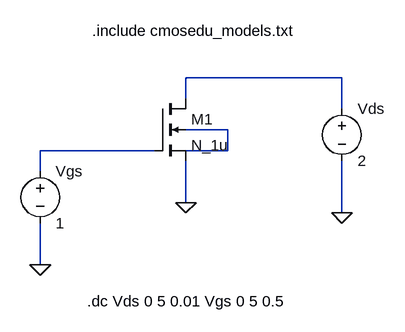
[diagram p0: schematic Parte3.asc]
Parte3.asc, the LTspice schematic file:
Version 4
SHEET 1 880 680
WIRE 384 64 144 64
WIRE 144 96 144 64
WIRE 384 112 384 64
WIRE 208 144 144 144
WIRE 96 176 -80 176
WIRE 208 176 208 144
WIRE 208 176 144 176
WIRE -80 208 -80 176
WIRE 144 256 144 192
WIRE 384 272 384 192
WIRE -80 352 -80 288
FLAG 144 256 0
FLAG 384 272 0
FLAG -80 352 0
SYMBOL nmos4 96 96 R0
SYMATTR InstName M1
SYMATTR Value N_1u
SYMATTR Value2 l=1.5u w=9.6u
SYMBOL voltage 384 96 R0
WINDOW 123 0 0 Left 2
WINDOW 39 0 0 Left 2
SYMATTR InstName Vds
SYMATTR Value 2
SYMBOL voltage -80 192 R0
WINDOW 123 0 0 Left 2
WINDOW 39 0 0 Left 2
SYMATTR InstName Vgs
SYMATTR Value 1
TEXT 0 -8 Left 2 !.include cmosedu_models.txt
TEXT -8 408 Left 2 !.dc Vds 0 5 0.01 Vgs 0 5 0.5

The netlist it stands for:
* Parte3.asc
M1 N001 N003 0 N002 N_1u l=1.5u w=9.6u
Vds N001 0 2
Vgs N003 0 1
.model NMOS NMOS
.model PMOS PMOS
.lib standard.mos
.include cmosedu_models.txt
.dc Vds 0 5 0.01 Vgs 0 5 0.5
.backanno
.end